# Altium schematic sheet PWM_OUTPUT.SchDoc
size A4; SheetNumber: 7; SheetTotal: 9
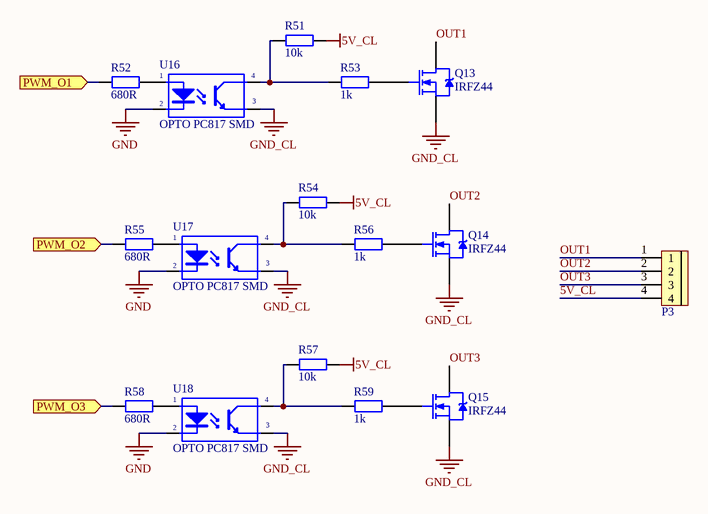
[diagram p0: PWM_OUTPUT.SchDoc]

## Parts
P3  CON 4 EDG5.08  [CON 4 4EDG5.08]  (value not drawn)
Q13  IRFZ44  [TO220]
Q14  IRFZ44  [TO220]
Q15  IRFZ44  [TO220]
R51  10k  [tro smd 0805]
R52  680R  [tro smd 0805]
R53  1k  [tro smd 0805]
R54  10k  [tro smd 0805]
R55  680R  [tro smd 0805]
R56  1k  [tro smd 0805]
R57  10k  [tro smd 0805]
R58  680R  [tro smd 0805]
R59  1k  [tro smd 0805]
U16  OPTO PC817 SMD  [SOP4]
U17  OPTO PC817 SMD  [SOP4]
U18  OPTO PC817 SMD  [SOP4]

## Ports
PWM_O1 (in), PWM_O2 (in), PWM_O3 (in)

## Nets
5V_CL: P3.4 R51.1 R54.1 R57.1
GND: U16.2(K) U17.2(K) U18.2(K)
GND_CL: Q13.3(S) Q14.3(S) Q15.3(S) U16.3(E) U17.3(E) U18.3(E)
OUT1: P3.1 Q13.2(D)
OUT2: P3.2 Q14.2(D)
OUT3: P3.3 Q15.2(D)
PWM_O1: R52.1 ; port PWM_O1
PWM_O2: R55.1 ; port PWM_O2
PWM_O3: R58.1 ; port PWM_O3
NetQ13_1: Q13.1(G) R53.2
NetQ14_1: Q14.1(G) R56.2
NetQ15_1: Q15.1(G) R59.2
NetR51_2: R51.2 R53.1 U16.4(C)
NetR52_2: R52.2 U16.1(A)
NetR54_2: R54.2 R56.1 U17.4(C)
NetR55_2: R55.2 U17.1(A)
NetR57_2: R57.2 R59.1 U18.4(C)
NetR58_2: R58.2 U18.1(A)

## Library data of the parts
P3 = CON 4 EDG5.08: Cắm; Ten_Linh_Kien: CON 4 2EDG5.08-4P 5.08MM ( Xanh Cong); Ma_Hang: MH000979; Don_Vi: Con; Ghi_Chu: *; Kieu_Chan: *; Chung_Loai: Cắm
Q13-Q15 = IRFZ44 DIP: N-Channel Power MOSFET
R51 R54 R57 = Tro 0805 1% 10k: Dán; Don_Vi: Con; So_Chan: 2; Ten_Linh_Kien: Trở 0805 1% 10k; Ma_Hang: MH005473; Chung_Loai: Dán; Kieu_Chan: *
R52 R55 R58 = Tro 0805 1% 680R: Dán; Don_Vi: Con; So_Chan: 2; Ten_Linh_Kien: Trở 0805 1% 680R; Ma_Hang: MH005487; Chung_Loai: Dán; Kieu_Chan: *
R53 R56 R59 = Tro 0805 1% 1k: Dán; Don_Vi: Con; So_Chan: 2; Ten_Linh_Kien: Trở 0805 1% 1k; Ma_Hang: MH005468; Chung_Loai: Dán; Kieu_Chan: *
U16-U18 = OPTO PC817 SMD: Single Opto; Value: PC817